# Altium schematic sheet USB_UART_Convertors.SchDoc
size A3; DocumentNumber: 4; SheetNumber: 4; SheetTotal: 9
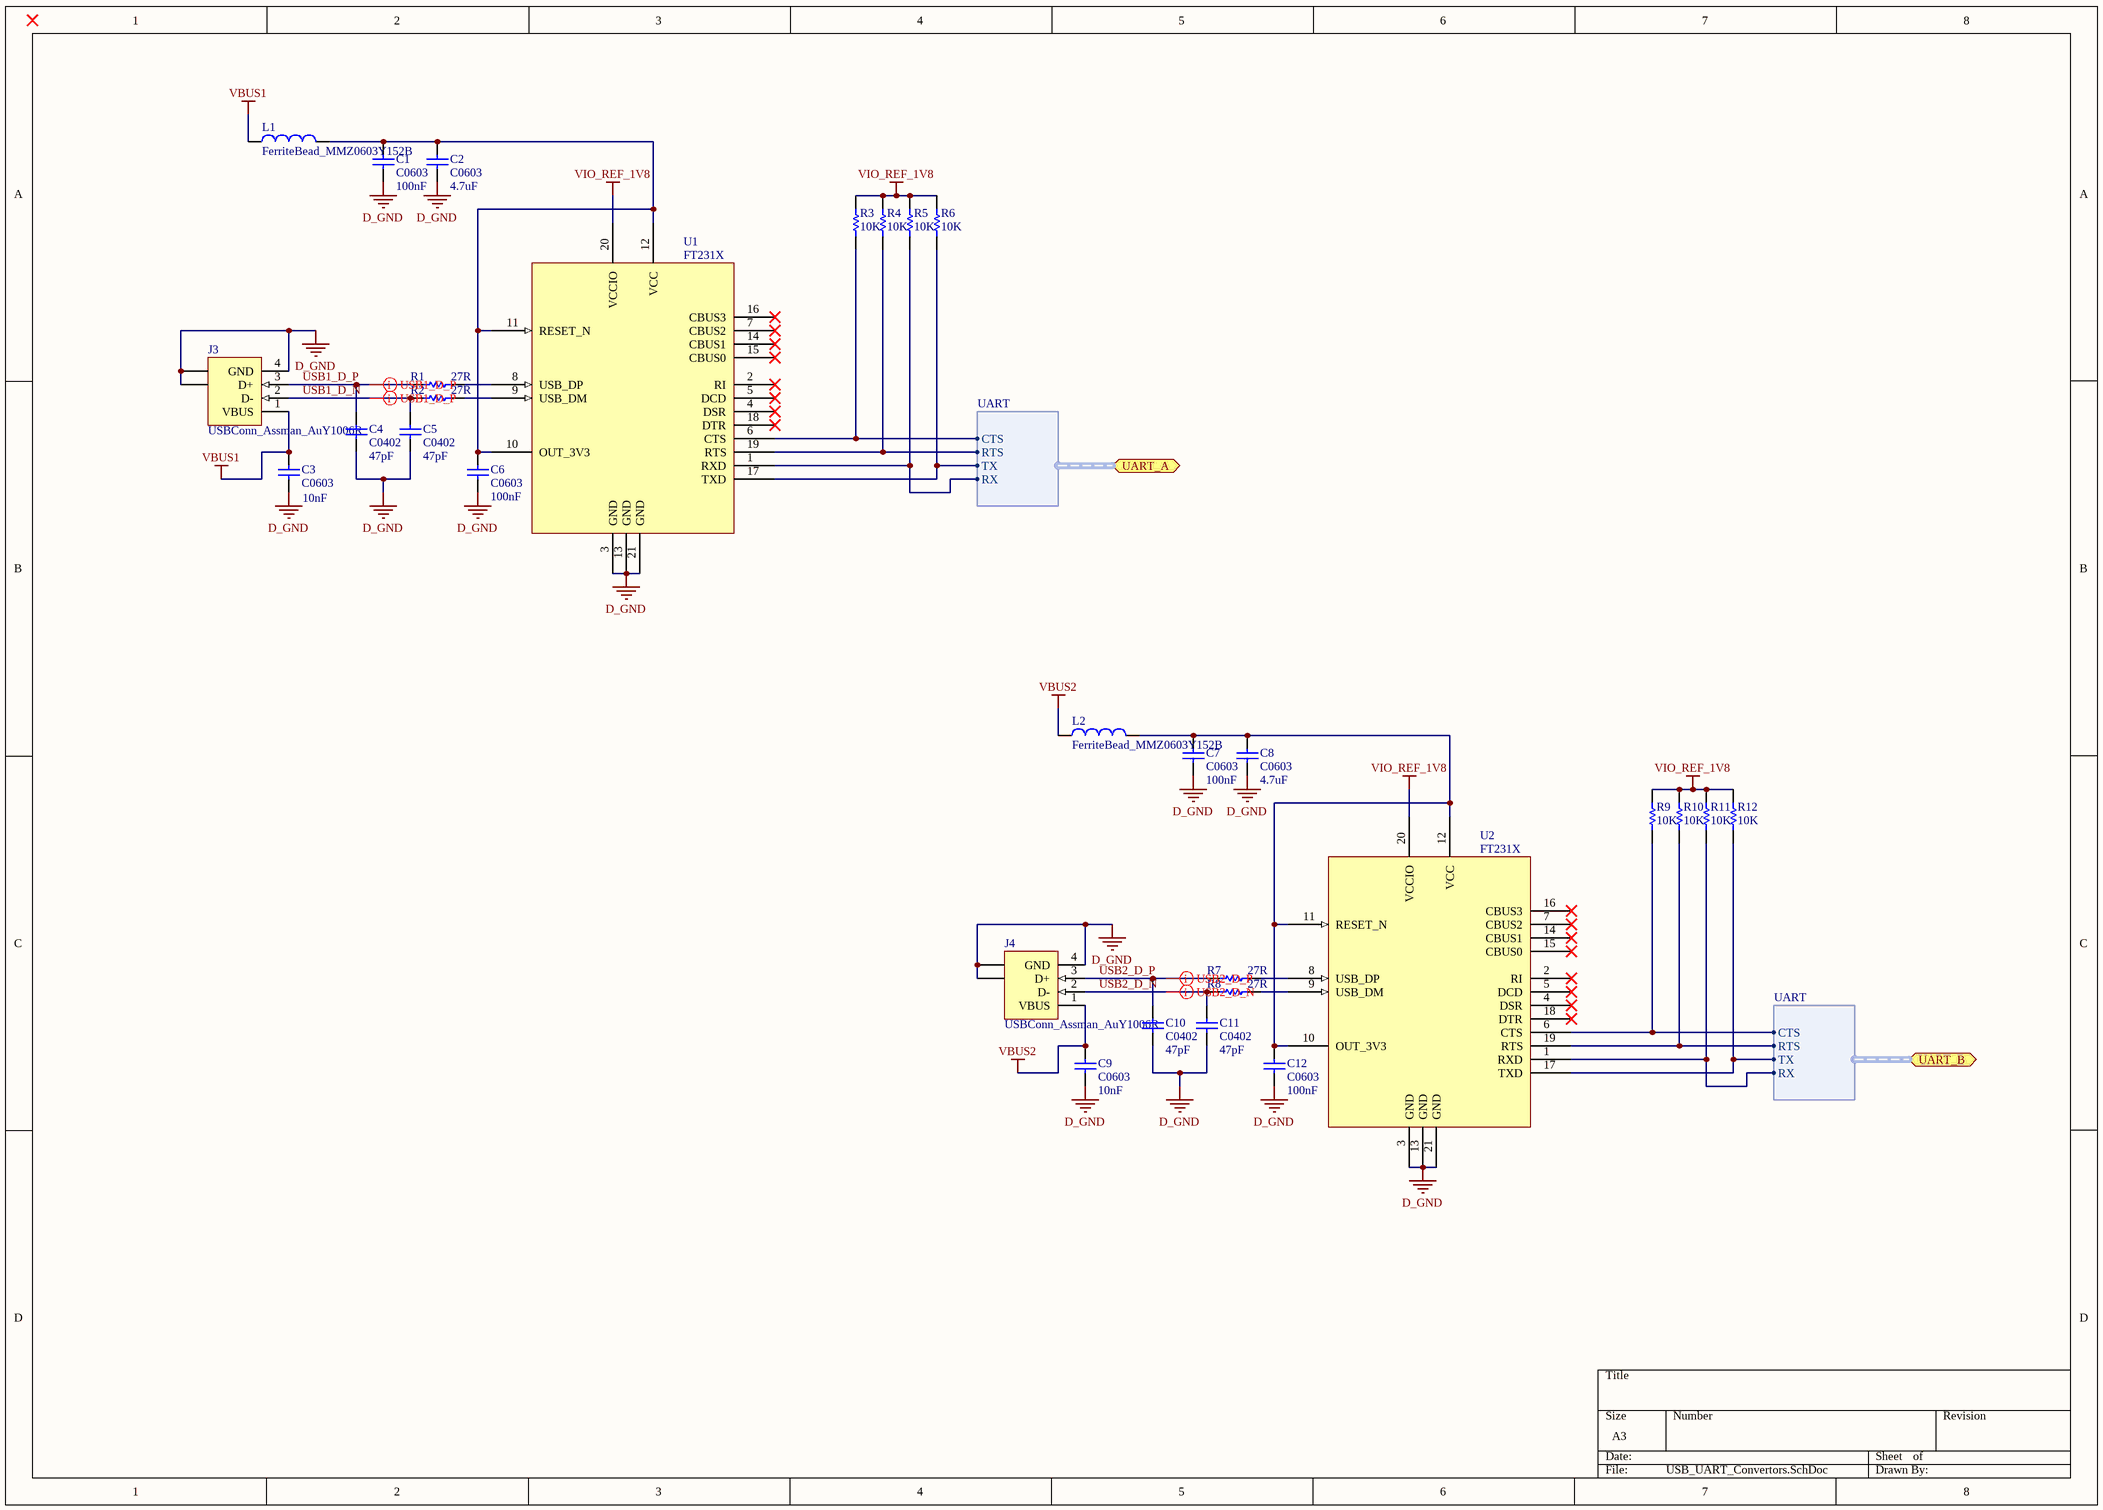
[diagram p0: USB_UART_Convertors.SchDoc]

## Parts
C1  C0603  value 100nF  [CAP_CER_0603_KEMET]
C2  C0603  value 4.7uF  [CAP_CER_0603_KEMET]
C3  C0603  value 10nF  [CAP_CER_0603_KEMET]
C4  C0402  value 47pF  [CAP_CER_0402_KEMET]
C5  C0402  value 47pF  [CAP_CER_0402_KEMET]
C6  C0603  value 100nF  [CAP_CER_0603_KEMET]
C7  C0603  value 100nF  [CAP_CER_0603_KEMET]
C8  C0603  value 4.7uF  [CAP_CER_0603_KEMET]
C9  C0603  value 10nF  [CAP_CER_0603_KEMET]
C10  C0402  value 47pF  [CAP_CER_0402_KEMET]
C11  C0402  value 47pF  [CAP_CER_0402_KEMET]
C12  C0603  value 100nF  [CAP_CER_0603_KEMET]
J3  USBConn_Assman_AuY1006R  [USBConn_Assman_AuY1006R]
J4  USBConn_Assman_AuY1006R  [USBConn_Assman_AuY1006R]
L1  FerriteBead_MMZ0603Y152B  [Chip2PinSM127P600-8N_FerriteBead_TDK]
L2  FerriteBead_MMZ0603Y152B  [Chip2PinSM127P600-8N_FerriteBead_TDK]
R1  27R  [RES_CHIP_0402]
R2  27R  [RES_CHIP_0402]
R3  10K  [RES_CHIP_0402]
R4  10K  [RES_CHIP_0402]
R5  10K  [RES_CHIP_0402]
R6  10K  [RES_CHIP_0402]
R7  27R  [RES_CHIP_0402]
R8  27R  [RES_CHIP_0402]
R9  10K  [RES_CHIP_0402]
R10  10K  [RES_CHIP_0402]
R11  10K  [RES_CHIP_0402]
R12  10K  [RES_CHIP_0402]
U1  FT231X  [QFN127P600-8N_FTDI_20PIN]
U2  FT231X  [QFN127P600-8N_FTDI_20PIN]

## Ports
UART_A (harness UART), UART_B (harness UART)

## Harnesses
UART: CTS, RTS, TX, RX

## Nets
D_GND: C1.1 C2.1 C3.1 C4.1 C5.1 C6.1 C7.1 C8.1 C9.1 C10.1 C11.1 C12.1 J3.4(GND) J3.5(SHLD) J3.6(SHLD) J4.4(GND) J4.5(SHLD) J4.6(SHLD) U1.3(GND) U1.13(GND) U1.21(GND) U2.3(GND) U2.13(GND) U2.21(GND)
VBUS1: C3.2 J3.1(VBUS) L1.1
VBUS2: C9.2 J4.1(VBUS) L2.1
VIO_REF_1V8: R3.2 R4.2 R5.2 R6.2 R9.2 R10.2 R11.2 R12.2 U1.20(VCCIO) U2.20(VCCIO)
USB1_D_N: C5.2 J3.2(D-) R2.2
USB1_D_P: C4.2 J3.3(D+) R1.2
USB2_D_N: C11.2 J4.2(D-) R8.2
USB2_D_P: C10.2 J4.3(D+) R7.2
NetC1_2: C1.2 C2.2 C6.2 L1.2 U1.10(OUT_3V3) U1.11(RESET_N) U1.12(VCC)
NetC7_2: C7.2 C8.2 C12.2 L2.2 U2.10(OUT_3V3) U2.11(RESET_N) U2.12(VCC)
NetR1_1: R1.1 U1.8(USB_DP)
NetR2_1: R2.1 U1.9(USB_DM)
NetR3_1: R3.1 U1.6(CTS) ; port UART_A.CTS
NetR4_1: R4.1 U1.19(RTS) ; port UART_A.RTS
NetR5_1: R5.1 U1.1(RXD) ; port UART_A.RX
NetR6_1: R6.1 U1.17(TXD) ; port UART_A.TX
NetR7_1: R7.1 U2.8(USB_DP)
NetR8_1: R8.1 U2.9(USB_DM)
NetR9_1: R9.1 U2.6(CTS) ; port UART_B.CTS
NetR10_1: R10.1 U2.19(RTS) ; port UART_B.RTS
NetR11_1: R11.1 U2.1(RXD) ; port UART_B.RX
NetR12_1: R12.1 U2.17(TXD) ; port UART_B.TX

Not connected (* = marked no-connect by the designer): U1 2(RI)* 4(DSR)* 5(DCD)* 7(CBUS2)* 14(CBUS1)* 15(CBUS0)* 16(CBUS3)* 18(DTR)*; U2 2(RI)* 4(DSR)* 5(DCD)* 7(CBUS2)* 14(CBUS1)* 15(CBUS0)* 16(CBUS3)* 18(DTR)*

## Layout directives
differential pair: USB1_D_N, USB1_D_P, USB2_D_N, USB2_D_P

## Library data of the parts
C1-C3 C6-C9 C12 = C0603: Ceramic Chip Capacitor - Standard; Note: Footprint corresponds to dimensions for bulk cassette packaging. This case size has tightened tolerances.; Published: 17-Jul-2002; LatestRevisionDate: 19-Mar-2004; LatestRevisionNote: Silkscreen size reduced.; DatasheetDocument: Mar-2001; PackageDocument: Mar-2001; PackageReference: 0603; Publisher: Altium Limited; Code_JEITA: 0603; Code_IPC: 1608 [0603]; ComponentLink1Description: Manufacturer Link; ComponentLink1URL: http://www.kemet.com/; ComponentLink2Description: Datasheet; ComponentLink2URL: http://www.kemet.com/kemet/web/homepage/kechome.nsf/vapubfilesname/F3102TA.pdf/$file/F3102TA.pdf
C4 C5 C10 C11 = C0402: Ceramic Chip Capacitor - Standard; Note: Footprint corresponds to dimensions for bulk cassette packaging. This case size has tightened tolerances.; Published: 17-Jul-2002; LatestRevisionDate: 19-Mar-2004; LatestRevisionNote: Silkscreen size reduced.; DatasheetDocument: Mar-2001; PackageDocument: Mar-2001; PackageReference: 0402; Publisher: Altium Limited; Code_JEITA: 0402; Code_IPC: 1005 [0402]; ComponentLink1Description: Manufacturer Link; ComponentLink1URL: http://www.kemet.com/; ComponentLink2Description: Datasheet; ComponentLink2URL: http://www.kemet.com/kemet/web/homepage/kechome.nsf/vapubfilesname/F3102TA.pdf/$file/F3102TA.pdf
J3 J4 = 1-353576-1: USB 1.1, Right Angle, SMT, A Type, Receptacle, 4 Position, White; ContactMaterial: Copper Alloy; ContactPlating: Gold over Palladium Nickel; PCB_Layout: Complies with manufacturer's recommendation.; DrillSize: Corresponds to nominal value.; PanelGround: Without; Published: 15-Jul-2004; DatasheetDocument: 11-Apr-2003; PackageDocument: 11-Apr-2003; PackageReference: 353576; Publisher: Altium Limited; HousingMaterial: Thermoplastic; ComponentLink1Description: Manufacturer Link; ComponentLink1URL: http://www.tycoelectronics.com/; ComponentLink2Description: Packaging Specification; ComponentLink2URL: http://ecommas.tycoelectronics.com/commerce/DocumentDelivery/DDEController?Action=showdoc&DocId=Customer+Drawing%7F353576%7FD%7Ftif%7FJapanese%7FJPN_CD_353576_D.tif
L1 L2 = Inductor: Code_IEC: 1005; Published: 8-Jun-2000; LatestRevisionDate: 29-May-2009; LatestRevisionNote: IPC-7351 Footprint Added.; PackageReference: 0402-A; Publisher: Altium Limited; PackageDescription: Chip Inductor; Code_JEITA: 0402
R1-R12 = ERJ2GE: Thick Film Chip Resistor, 1 Ohm to 2.2M Ohm Range, 5% Tolerance, 0402 Size, 0.063 W; Note: If flow soldering, adjust pad width of PCB Footprint to 0.7 - 0.8 times the width of the resistor.; Published: 17-Dec-2003; LatestRevisionDate: 19-Mar-2004; LatestRevisionNote: Silkscreen size reduced.; PackageDocument: Mar-2003; PackageReference: 2-0402; Publisher: Altium Limited; Code_IPC: 1005 [0402]; ComponentLink1Description: Manufacturer Link; ComponentLink1URL: http://www.panasonic.com/industrial/components/resistive_products.htm; ComponentLink2Description: Datasheet; ComponentLink2URL: http://www.panasonic.com/industrial/components/pdf/AOA0000CE1.pdf